# Altium schematic sheet PSU_module.SchDoc
size A4; SheetNumber: 1; SheetTotal: 1
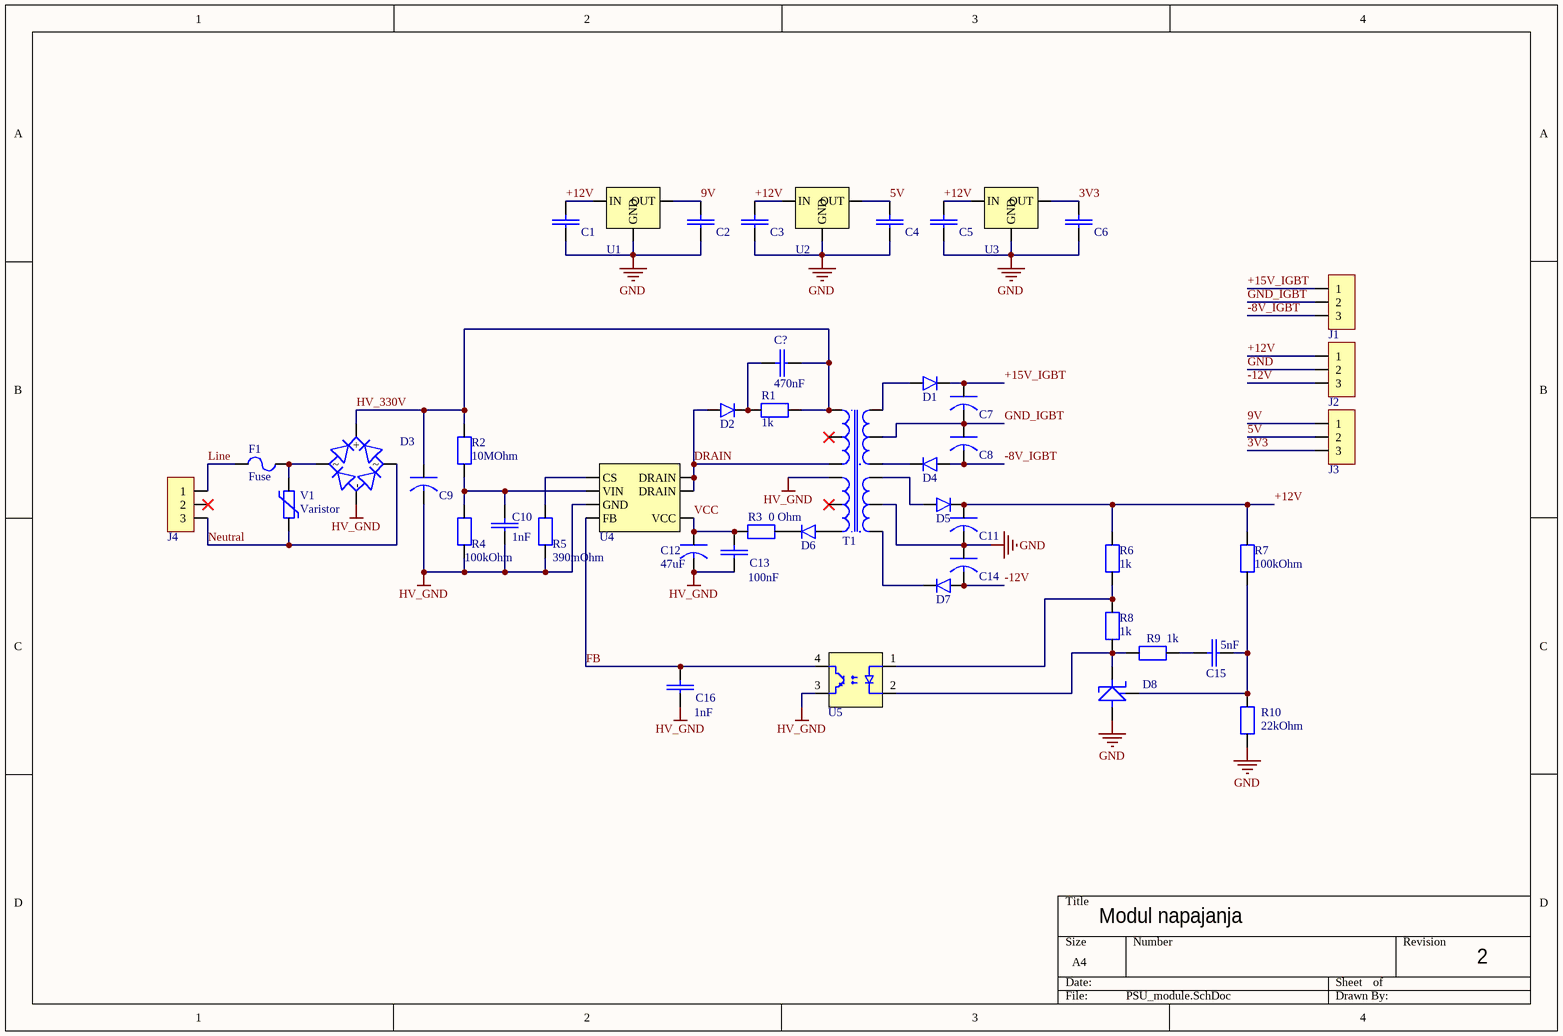
[diagram p0: PSU_module.SchDoc]

## Parts
C1  Capacitor-NP  [C-NP]  (value not drawn)
C2  Capacitor-NP  [C-NP]  (value not drawn)
C3  Capacitor-NP  [C-NP]  (value not drawn)
C4  Capacitor-NP  [C-NP]  (value not drawn)
C5  Capacitor-NP  [C-NP]  (value not drawn)
C6  Capacitor-NP  [C-NP]  (value not drawn)
C7  Capacitor-P  [C-P-50V]  (value not drawn)
C8  Capacitor-P  [C-P-50V]  (value not drawn)
C9  Capacitor-P  [C-P-400V]  (value not drawn)
C10  value 1nF  [C-NP]  (hidden comment: Capacitor-NP)
C11  Capacitor-P  [C-P-50V]  (value not drawn)
C12  value 47uF  [C-P-50V]  (hidden comment: Capacitor-P)
C13  value 100nF  [C-NP]  (hidden comment: Capacitor-NP)
C14  Capacitor-P  [C-P-50V]  (value not drawn)
C15  value 5nF  [C-NP]  (hidden comment: Capacitor-NP)
C16  value 1nF  [C-NP]  (hidden comment: Capacitor-NP)
C?  value 470nF  [C-NP]  (hidden comment: Capacitor-NP)
D1  Diode  [Diode]  (value not drawn)
D2  Diode  [Diode]  (value not drawn)
D3  BridgeRectifier  [BridgeRectifier]  (value not drawn)
D4  Diode  [Diode]  (value not drawn)
D5  Diode  [Diode]  (value not drawn)
D6  Diode  [Diode]  (value not drawn)
D7  Diode  [Diode]  (value not drawn)
D8  431-zener  [431-zener]  (value not drawn)
F1  Fuse  [FuseHolder]
J1  Molex Micro-Latch  [ScrewTerminal]  (value not drawn)
J2  Molex Micro-Latch  [ScrewTerminal]  (value not drawn)
J3  Molex Micro-Latch  [ScrewTerminal]  (value not drawn)
J4  Molex Micro-Latch  [ScrewTerminal]  (value not drawn)
R1  1k  [R-2W]
R2  10MOhm  [R-2W]
R3  0 Ohm  [R-2W]
R4  100kOhm  [R-2W]
R5  390mOhm  [R-5W]
R6  1k  [R-2W]
R7  100kOhm  [R-2W]
R8  1k  [R-2W]
R9  1k  [R-2W]
R10  22kOhm  [R-2W]
T1  -  [CustomTrafo]  (value not drawn)
U1  Linear-regulator  [LinearReg]  (value not drawn)
U2  Linear-regulator  [LinearReg]  (value not drawn)
U3  Linear-regulator  [LinearReg]  (value not drawn)
U4  NCP11187  [NCP11187]  (value not drawn)
U5  Optocoupler  [Opto]  (value not drawn)
V1  Varistor  [VARRBO750W80L1350T640H1650]

## Nets
GND: C1.1 C2.1 C3.1 C4.1 C5.1 C6.1 C11.1 C14.2 D8.3(A) J2.2 R10.1 T1.8 U1.2(GND) U2.2(GND) U3.2(GND)
HV_GND: C9.1 C10.1 C12.1 C13.1 C16.1 D3.4(-) R4.1 R5.1 T1.4 U4.3(GND) U5.3(E)
3V3: C6.2 J3.3 U3.3(OUT)
5V: C4.2 J3.2 U2.3(OUT)
9V: C2.2 J3.1 U1.3(OUT)
+12V: C1.2 C3.2 C5.2 C11.2 D5.C J2.1 R6.2 R7.2 U1.1(IN) U2.1(IN) U3.1(IN)
+15V_IGBT: C7.2 D1.C J1.1
-8V_IGBT: C8.1 D4.A J1.3
-12V: C14.1 D7.A J2.3
DRAIN: D2.A T1.3 U4.6(DRAIN) U4.7(DRAIN)
FB: C16.2 U4.4(FB) U5.4(C)
GND_IGBT: C7.1 C8.2 J1.2 T1.11
HV_330V: C9.2 C?.1 D3.1(+) R1.1 R2.2 T1.1
Line: F1.1 J4.1
Neutral: D3.2 J4.3 V1.1
VCC: C12.2 C13.2 R3.2 U4.5(VCC)
NetC10_2: C10.2 R2.1 R4.2 U4.2(VIN)
NetC15_1: C15.1 D8.2(REF) R7.1 R10.2
NetC15_2: C15.2 R9.1
NetC?_2: C?.2 D2.C R1.2
NetD1_A: D1.A T1.12
NetD3_3: D3.3 F1.2 V1.2
NetD4_C: D4.C T1.10
NetD5_A: D5.A T1.9
NetD6_A: D6.A T1.6
NetD6_C: D6.C R3.1
NetD7_C: D7.C T1.7
NetD8_1: D8.1(C) R8.1 R9.2 U5.2(K)
NetR5_2: R5.2 U4.1(CS)
NetR6_1: R6.1 R8.2 U5.1(A)

Not connected (* = marked no-connect by the designer): J4 2*; T1 2* 5*

## Notes on the sheet
- Modul napajanja
- 2

## Library data of the parts
C1 C3 C5 = Capacitor-NP: Value: 330nF
C2 C4 C6 = Capacitor-NP: Value: 100nF
C7-C9 C11 C14 = Capacitor-P: Value: 47uF
F1 = F_30A: Part Number: F_30A; Value: Fuse holder; FR_SN: F-04
J1-J4 = Molex Micro-Latch 1x3: Manufacturer Part Number: 53254-0370; ComponentLinkDescription: Datasheet; FR_SN: J-13; Part Number: Molex Micro-Latch 1x3; Value: Molex Micro-Latch; ComponentLinkURL: https://hr.mouser.com/datasheet/2/276/0532540370_PCB_HEADERS-171041.pdf; Supplier Part Number: 538-53254-0370
R1-R10 = Resistor
  R1 R6 R8 R9: Value: 1k
  R2: Value: 10MOhm
  R3: Value: 0 Ohm
  R4 R7: Value: 100kOhm
  R5: Value: 390mOhm
  R10: Value: 22kOhm
T1 = Custom transformer: FR_SN: T-2; Part Number: Custom transformer; Value: -; DC Current Rating: -; Inductor Case Style: -; Manufacturer Part Number: -; ComponentLinkURL: -; ComponentLinkDescription: -; Supplier Part Number: -
U5 = ACPL-217: Manufacturer Part Number: ACPL-217-56BE; Max Reverse Voltage: 6V; Diode Case Style: SOIC-4; Forward Current: 50 mA; ComponentLinkDescription: Datasheet; FR_SN: D_LED-09; Part Number: ACPL-217; Value: Optocoupler; Diode Type: -; ComponentLinkURL: https://eu.mouser.com/datasheet/2/678/AV02-0470EN_DS_ACPL-217_2018-02-12-1827799.pdf; Supplier Part Number: 630-ACPL-217-56BE
V1 = B72314S2351K101: FR_SN: Var-01; Part Number: B72314S2351K101